# Altium project ESE516_Whiskeypedia_A5.PrjPcb (part 1 of 2)
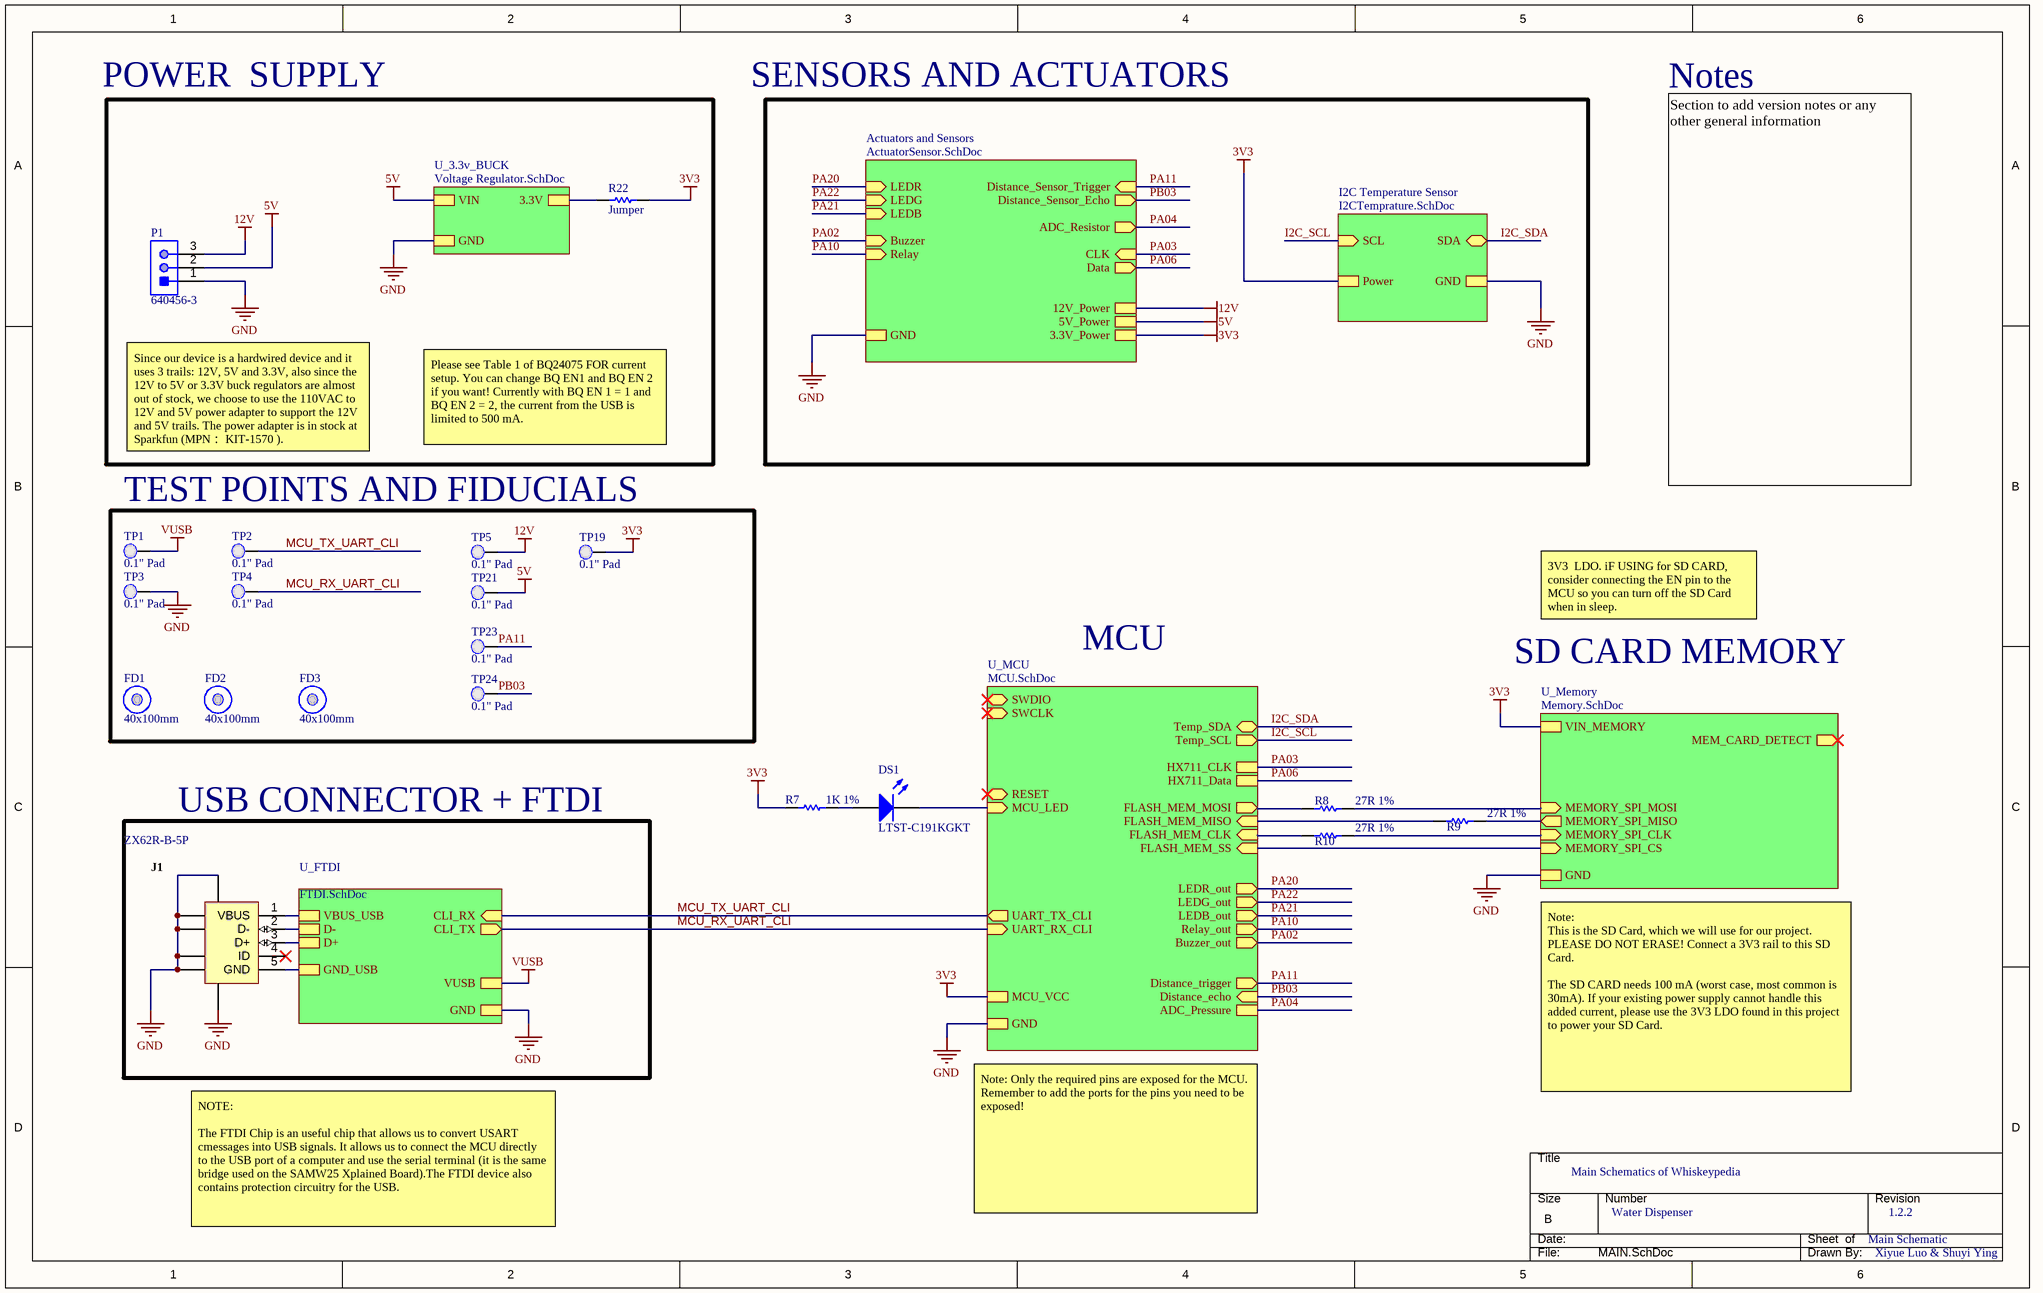
[diagram p0: MAIN.SchDoc]
7 sheets, 125 parts. Net scope: hierarchical (ports join the sheet entries above them; power ports are global).
Board file: ESE516_PCB.PcbDoc
Sheets:
  MAIN.SchDoc
    U_FTDI = FTDI.SchDoc
    U_MCU = MCU.SchDoc
    U_Memory = Memory.SchDoc
    U_3.3v_BUCK = Voltage Regulator.SchDoc
    Actuators and Sensors = ActuatorSensor.SchDoc
    I2C Temperature Sensor = I2CTemprature.SchDoc

## Sheet MAIN.SchDoc
size B

### Parts
DS1  LTST-C191KGKT  [LITE-ON-LTST-C191KRKT-2_V]
FD1  40x100mm  [Fiducial_FT]  (no BOM)
FD2  40x100mm  [Fiducial_FT]  (no BOM)
FD3  40x100mm  [Fiducial_FT]  (no BOM)
J1  ZX62R-B-5P  [HIRO-ZX62R-B-5P_V]
P1  640456-3  [TECO-640456-3]
R7  1K 1%  [RESC0603(1608)_N]
R8  27R 1%  [RESC1005X40X25NL10T10]
R9  27R 1%  [RESC1005X40X25NL10T10]
R10  27R 1%  [RESC1005X40X25NL10T10]
R22  Jumper  [RESC0805(2012)_N]
TP1  0.1" Pad  [PCBComponent]  (no BOM)
TP2  0.1" Pad  [PCBComponent]  (no BOM)
TP3  0.1" Pad  [PCBComponent]  (no BOM)
TP4  0.1" Pad  [PCBComponent]  (no BOM)
TP5  0.1" Pad  [PCBComponent]  (no BOM)
TP19  0.1" Pad  [PCBComponent]  (no BOM)
TP21  0.1" Pad  [PCBComponent]  (no BOM)
TP23  0.1" Pad  [PCBComponent]  (no BOM)
TP24  0.1" Pad  [PCBComponent]  (no BOM)

### Blocks framed on the sheet
TEST POINTS AND FIDUCIALS: FD1-FD3 TP1-TP5 TP19 TP21 TP23 TP24
USB CONNECTOR + FTDI: J1

### Sub-sheets
Actuators and Sensors = ActuatorSensor.SchDoc: LEDR (in), LEDG (in), LEDB (in), Buzzer (in), Relay (in), Distance_Sensor_Trigger (in), Distance_Sensor_Echo (out), GND, 5V_Power, 3.3V_Power, 12V_Power, ADC_Resistor (out), CLK (in), Data (out)
I2C Temperature Sensor = I2CTemprature.SchDoc: SCL (in), Power, SDA (bidir), GND
U_3.3v_BUCK = Voltage Regulator.SchDoc: VIN, 3.3V, GND
U_FTDI = FTDI.SchDoc: CLI_RX (in), CLI_TX (out), VUSB, GND, VBUS_USB, D-, D+, GND_USB
U_MCU = MCU.SchDoc: SWDIO (bidir), SWCLK (in), UART_TX_CLI (out), UART_RX_CLI (in), FLASH_MEM_SS (in), FLASH_MEM_CLK (in), FLASH_MEM_MISO (in), FLASH_MEM_MOSI (out), RESET (bidir), MCU_LED (in), MCU_VCC, GND, LEDR_out (out), LEDG_out (out), LEDB_out (out), Relay_out (out), Buzzer_out (out), Distance_trigger (out), Distance_echo (in), Temp_SDA (bidir), Temp_SCL (out), ADC_Pressure, HX711_CLK, HX711_Data
U_Memory = Memory.SchDoc: MEMORY_SPI_MOSI (in), MEMORY_SPI_MISO (out), MEMORY_SPI_CLK (in), MEMORY_SPI_CS (in), MEM_CARD_DETECT (out), VIN_MEMORY, GND

### Nets
3V3: R7.1 R22.1 R22.2 TP19.1(PAD) ; sheet U_MCU/MCU_VCC, sheet U_Memory/VIN_MEMORY, sheet U_3.3v_BUCK/3.3V, sheet Actuators and Sensors/3.3V_Power, sheet I2C Temperature Sensor/Power
5V: P1.2 TP21.1(PAD) ; sheet U_3.3v_BUCK/VIN, sheet Actuators and Sensors/5V_Power
12V: P1.3 TP5.1(PAD) ; sheet Actuators and Sensors/12V_Power
GND: J1.6(SHLD) J1.7(SHLD) J1.8(SHLD) J1.9(SHLD) J1.10(SHLD) J1.11(SHLD) P1.1 TP3.1(PAD) ; sheet U_FTDI/GND, sheet U_MCU/GND, sheet U_Memory/GND, sheet U_3.3v_BUCK/GND, sheet Actuators and Sensors/GND, sheet I2C Temperature Sensor/GND
VUSB: TP1.1(PAD) ; sheet U_FTDI/VUSB
FLASH_MEM_SPI_SS: sheet U_MCU/FLASH_MEM_SS, sheet U_Memory/MEMORY_SPI_CS
GND_USB: J1.5(GND) ; sheet U_FTDI/GND_USB
I2C_SCL: sheet U_MCU/Temp_SCL, sheet I2C Temperature Sensor/SCL
I2C_SDA: sheet U_MCU/Temp_SDA, sheet I2C Temperature Sensor/SDA
MCU_LED: DS1.2(K) ; sheet U_MCU/MCU_LED
MCU_RX_UART_CLI: TP4.1(PAD) ; sheet U_FTDI/CLI_TX, sheet U_MCU/UART_RX_CLI
MCU_TX_UART_CLI: TP2.1(PAD) ; sheet U_FTDI/CLI_RX, sheet U_MCU/UART_TX_CLI
MEM_SPI_CLK: R10.2 ; sheet U_Memory/MEMORY_SPI_CLK
MEM_SPI_MISO: R9.2 ; sheet U_Memory/MEMORY_SPI_MISO
MEM_SPI_MOSI: R8.2 ; sheet U_Memory/MEMORY_SPI_MOSI
PA02: sheet U_MCU/Buzzer_out, sheet Actuators and Sensors/Buzzer
PA03: sheet U_MCU/HX711_CLK, sheet Actuators and Sensors/CLK
PA04: sheet U_MCU/ADC_Pressure, sheet Actuators and Sensors/ADC_Resistor
PA06: sheet U_MCU/HX711_Data, sheet Actuators and Sensors/Data
PA10: sheet U_MCU/Relay_out, sheet Actuators and Sensors/Relay
PA11: TP23.1(PAD) ; sheet U_MCU/Distance_trigger, sheet Actuators and Sensors/Distance_Sensor_Trigger
PA20: sheet U_MCU/LEDR_out, sheet Actuators and Sensors/LEDR
PA21: sheet U_MCU/LEDB_out, sheet Actuators and Sensors/LEDB
PA22: sheet U_MCU/LEDG_out, sheet Actuators and Sensors/LEDG
PB03: TP24.1(PAD) ; sheet U_MCU/Distance_echo, sheet Actuators and Sensors/Distance_Sensor_Echo
SERCOM1_PAD2_SPI_MISO: R9.1 ; sheet U_MCU/FLASH_MEM_MISO
SERCOM1_PAD2_SPI_MOSI: R8.1 ; sheet U_MCU/FLASH_MEM_MOSI
SERCOM1_PAD3_SPI_SCK: R10.1 ; sheet U_MCU/FLASH_MEM_CLK
USB_DATA_N: J1.2(D-) ; sheet U_FTDI/D-
USB_DATA_P: J1.3(D+) ; sheet U_FTDI/D+
VBUS_USB: J1.1(VBUS) ; sheet U_FTDI/VBUS_USB
NetDS1_1: DS1.1(A) R7.2

Not connected (* = marked no-connect by the designer): J1 4(ID)*

### Notes on the sheet
- POWER  SUPPLY
- SENSORS AND ACTUATORS
- Notes
- Since our device is a hardwired device and it uses 3 trails: 12V, 5V and 3.3V, also since the 12V to 5V or 3.3V buck regulators are almost out of stock, we choose to use the 110VAC to 12V and 5V power adapter to support the 12V and 5V trails. The power adapter is in stock at Sparkfun (MPN： KIT-1570 ).
- Please see Table 1 of BQ24075 FOR current setup. You can change BQ EN1 and BQ EN 2 if you want! Currently with BQ EN 1 = 1 and BQ EN 2 = 2, the current from the USB is limited to 500 mA.
- Section to add version notes or any other general information
- 3V3  LDO. iF USING for SD CARD, consider connecting the EN pin to the MCU so you can turn off the SD Card when in sleep.
- MCU
- SD CARD MEMORY
- Note:
  This is the SD Card, which we will use for our project. PLEASE DO NOT ERASE! Connect a 3V3 rail to this SD Card.
  The SD CARD needs 100 mA (worst case, most common is 30mA). If your existing power supply cannot handle this added current, please use the 3V3 LDO found in this project to power your SD Card.
- Main Schematics of Whiskeypedia
- NOTE:
  The FTDI Chip is an useful chip that allows us to convert USART cmessages into USB signals. It allows us to connect the MCU directly to the USB port of a computer and use the serial terminal (it is the same bridge used on the SAMW25 Xplained Board).The FTDI device also contains protection circuitry for the USB.
- Note: Only the required pins are exposed for the MCU. Remember to add the ports for the pins you need to be exposed!
- Water Dispenser
- Main Schematic
- 1.2.2
- Xiyue Luo & Shuyi Ying

### Library data of the parts
DS1 = CMP-2000-05198-1: Chip LED, Green, 574 nm, 40 pF, -55 to 85 degC, 2-Pin SMD, RoHS, Tape and Reel; Manufacturer: Lite-On; Rad Hardened: No; Emitting Color: YellowGreen; Product Height (mm): 0.55mm; Forward Voltage: 2.4V; Number of Elements: 1; Dominant Wave Length: 571nm; DELETED: Compliant; Viewing Angle: 130deg; High Brightness: Yes; Peak Wavelength: 574nm; Type: Uni-Color; Forward Current: 30mA; Product Length (mm): 1.6mm; Luminous Intensity: 35mcd; Test Current (It): 20mA; Chip Material: AlGaInP; Product Depth (mm): 0.8mm; Shape Type: Rectangular; Reverse Voltage: 5V; Power Dissipation: 75W; Pin Count: 2; Lens Dimensions: 1.1X0.8X0.37mm; Packaging: TapeandReel; Main Category: ChipLED; Operating Temperature Classification: Industrial; Package Type: ChipLed; Mounting: SurfaceMount; Lum Intensity: 35mcd; Operating Temp Range: -55Cto85C; Datasheet Version: Jan-07; Datasheet URL: http://download.siliconexpert.com/pdfs/2007/08/26/semi_b/manual/lot/ds/ltst-c191kgkt.pdf; Manufacturer URL: http://www.us.liteon.com/
FD1-FD3 = CMP-00174-A.4: Fiducial 40x100mm
J1 = CMP-0031-00001-1: Connector; USBMicro-B,Reverse type, SMT; 5 Position; Right Angle; DatasheetVersion: 08/2010; Operating Temperature: -30 to 85 degC; Mounting Technology: Surface Mount; PartNumber: ZX62R-B-5P; PackageReference: ZX62R-B-5P; ComponentLink2URL: http://www.hirose.co.jp/cataloge_hp/e24200011.pdf; ComponentLink1URL: http://www.hirose.com/â€Ž; ComponentLink2Description: Datasheet; PackageDescription: 5-Pin USB Micro-B R/A Connector; ComponentLink1Description: Manufacturer URL
P1 = CMP-2000-05418-1: Male Header, Pitch 2.54 mm, 1 x 3 Position, Height 10.03 mm, Tail Length 3.56 mm, -55 to 105 degC; Manufacturer: TE Connectivity; Agency Approvals: CSA,UL; Angle: Straight; Number of Positions: 3; Standards: RoHSCompliant,ELVCompliant,UL94V-0; Current, Rating: 5 / A; Connector Type: MTA-100; Mount Angle: Vertical; Material, Housing: Polyester; Temperature, Operating: -55to+105 / degC; Voltage, Rating: 250 / V; Color, Housing: White; Contact Centerline Spacing: 0.100 / in.; Special Features: Pinstrip; Material, Contact: CopperAlloy; Contact Termination Area Plating: Tin; Primary Type: InterconnectSystem; Pin Spacing: 0.1 / "; Brand/Series: MTA-100Series; Mounting Hole Size: 0.04 / "; Manufacturer URL: http://www.te.com/; Datasheet URL: https://datasheet.ciiva.com/16456/eng-ds-82056-mta-0608-16456886.pdf; Flammability Rating: UL94V-0; Mounting Type: PCMount; Contact Mating Area Plating: Tin; Datasheet Version: Jun-08; Number of Rows: 1; Termination: Solder; Type: PCBPlug; Length, Pin: 0.14 / "; Color: White; Contact Plating: Tin; Contact Shape: Square; Number of Contacts: 3; Size, Post: 0.025 / in.; Length, Terminal Post: 0.14 / in.; Length, Overall: 0.3 / "
R7 = CMP-1012-00510-1: 1K 0.1W 1% 0603 (1608 Metric)  SMD; Case-Metric: 1608; Case-EIA: 0603; Value: 1000.00 Ohm; Technology: SMT; Tolerance: 1 %; Power: 0.1 W
R8-R10 = CMP-2002-06087-1: Manufacturer: Multicomp; Part Number: MC00625W0402127R
R22 = CMP-1013-00001-1: Jumper 0805 (2012 Metric); Case-EIA: 0805; Value: 0.00 Ohm; Tolerance: None; Case-Metric: 2012; Technology: SMT; Power: None
TP1-TP5 TP19 TP21 TP23 TP24 = 0.1" Pad-A.4

## Sheet FTDI.SchDoc
size A
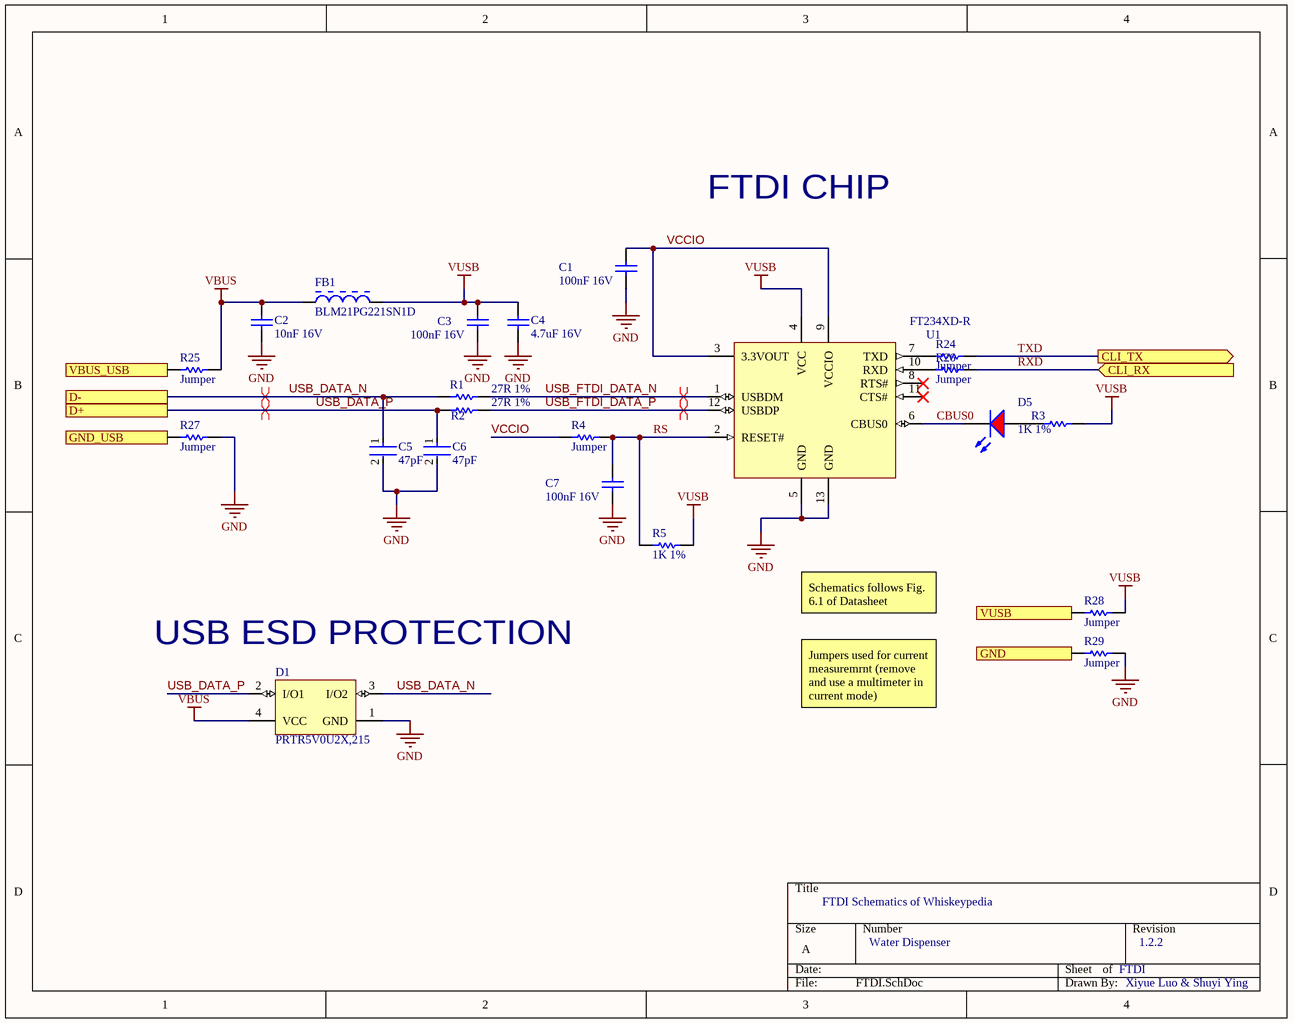
[diagram p1: FTDI.SchDoc]

### Parts
C1  100nF 16V  [CAPC0603(1608)100_N]
C2  10nF 16V  [CAPC0603(1608)100_N]
C3  100nF 16V  [CAPC0603(1608)100_N]
C4  4.7uF 16V  [CAPC0805(2012)145_N]
C5  47pF  [FP-C0603C-CF-MFG]
C6  47pF  [FP-C0603C-CF-MFG]
C7  100nF 16V  [CAPC0603(1608)100_N]
D1  PRTR5V0U2X,215  [NXP-SOT143B-4_V]
D5  LTST-C170CKT  [LTST-C170CKT_V]  (value not drawn)
FB1  BLM21PG221SN1D  [MURA-BLM21-B20-CHIP-2_V2]
R1  27R 1%  [RESC1005X40X25NL10T10]
R2  27R 1%  [RESC1005X40X25NL10T10]
R3  1K 1%  [RESC0603(1608)_N]
R4  Jumper  [RESC0805(2012)_N]
R5  1K 1%  [RESC0603(1608)_N]
R24  Jumper  [RESC0805(2012)_N]
R25  Jumper  [RESC0805(2012)_N]
R26  Jumper  [RESC0805(2012)_N]
R27  Jumper  [RESC0805(2012)_N]
R28  Jumper  [RESC0805(2012)_N]
R29  Jumper  [RESC0805(2012)_N]
U1  FT234XD-R  [DFN-12_V]

### Ports
CLI_RX (in), CLI_TX (out), D+, D-, GND, GND_USB, VBUS_USB, VUSB

### Nets
GND: C1.1 C2.1 C3.1 C4.1 C5.2 C6.2 C7.1 D1.1(GND) R27.2 R29.1 R29.2 U1.5(GND) U1.13(GND) ; port GND
VBUS: C2.2 D1.4(VCC) FB1.1 R25.2
VUSB: C3.2 C4.2 FB1.2 R3.2 R5.1 R28.1 R28.2 U1.4(VCC) ; port VUSB
CBUS0: D5.2(K) U1.6(CBUS0)
GND_USB: R27.1 ; port GND_USB
RS: C7.2 R4.2 R5.2 U1.2(RESET#)
RXD: R26.2 ; port CLI_RX  [project net MCU_TX_UART_CLI]
TXD: R24.2 ; port CLI_TX  [project net MCU_RX_UART_CLI]
USB_DATA_N: C5.1 D1.3(I/O2) R1.1 ; port D-
USB_DATA_P: C6.1 D1.2(I/O1) R2.1 ; port D+
USB_FTDI_DATA_N: R1.2 U1.1(USBDM)
USB_FTDI_DATA_P: R2.2 U1.12(USBDP)
VBUS_USB: R25.1 ; port VBUS_USB
VCCIO: C1.2 R4.1 U1.3(3.3VOUT) U1.9(VCCIO)
NetD5_1: D5.1(A) R3.1
NetR24_1: R24.1 U1.7(TXD)
NetR26_1: R26.1 U1.10(RXD)

Not connected (* = marked no-connect by the designer): U1 8(RTS#)* 11(CTS#)*

### Layout directives
differential pair: USB_DATA_N, USB_DATA_P, USB_FTDI_DATA_N, USB_FTDI_DATA_P

### Notes on the sheet
- FTDI CHIP
- Schematics follows Fig. 6.1 of Datasheet
- (near D1) USB ESD PROTECTION
- Jumpers used for current measuremrnt (remove and use a multimeter in current mode)
- FTDI Schematics of Whiskeypedia
- Water Dispenser
- FTDI
- 1.2.2
- Xiyue Luo & Shuyi Ying

### Library data of the parts
C1 C3 C7 = CMP-1035-02584-1: CAP 100nF 16V ±10% 0603 (1608 Metric) Thickness 1mm SMD; Tolerance: Â±10%; Case-EIA: 0603; Case-Metric: 1608; Technology: SMT; Max Thickness: 1 mm; Value: 100nF; Rated Voltage: 16 V
C2 = CMP-1035-02311-1: CAP 10nF 16V ±10% 0603 (1608 Metric) Thickness 1mm SMD; Case-EIA: 0603; Case-Metric: 1608; Tolerance: Â±10%; Rated Voltage: 16 V; Value: 10nF; Max Thickness: 1 mm; Technology: SMT
C4 = CMP-1036-04893-1: CAP 4.7uF 16V -20% to +80% 0805 (2012 Metric) Thickness 1.45mm SMD; Case-Metric: 2012; Case-EIA: 0805; Max Thickness: 1.45 mm; Value: 4.7uF; Rated Voltage: 16 V; Tolerance: -20% to +80%; Technology: SMT
C5 C6 = CMP-03020-020014-1: CAP CER 47PF 16V NP0 0603; Manufacturer Part Number: C0603C470J4GAC7867; Manufacturer: KEMET; Material: Ceramic; Temperature Characteristic: C0G; Temperature Coefficient: 30ppm/°C; Automotive Grade: Grade 1; Tolerance: 0.05; Category: Cap; Package: C0603C-CF; Temperature Range Low: -55°C; Octopart: https://octopart.com/c0603c470j4gac7867-kemet-2107619; Height: 0.87mm; Value: 47 pF; Device Class L2: Capacitors; RoHS: TRUE; ComponentLink2URL: https://api.kemet.com/component-edge/download/datasheet/C0603C100J5GACAUTO.pdf; Voltage Rating: 16 V; Capacitance: 47 pF; Automotive: Yes; Device Class L1: Passive Components; Digikey Description: CAP CER 47PF 16V NP0 0603; ComponentLink2Description: Datasheet; Temperature Range High: +125°C; Device Class L3: Ceramic Capacitors; Lead Free: Yes; Temperature: -55°C to +125°C
D1 = CMP-2000-05285-1: Ultra Low Capacitance Double Rail-to-Rail ESD Protection Diode, 5.5 V, 1 pF, -40 to 85 degC, 4-Pin SOT143B, RoHS, Tape and Reel; Manufacturer: NXP Semiconductors; Capacitance Value: 16pF; Number of Elements: 1; Rad Hardened: No; Reverse Breakdown Voltage: 6V; Working Voltage (Max): 5.5V; Polarity: Uni-Directional; Configuration: Quad; Leakage Current: 0.1uA; Product Height (mm): 1mm; Suppressor Type: DiodeArrays; Product Length (mm): 3mm; Product Depth (mm): 1.4mm; ESD Protection Voltage: 8KV@ContactDisc; Package Type: SOT; Mounting: SurfaceMount; Packaging: TapeandReel; Datasheet Version: Rev. 02, 01/2008; Reverse Stand-off Voltage: 5.5V; Manufacturer URL: http://www.nxp.com/; Operating Temp Range: -40Cto85C; Operating Temperature Classification: Industrial; Working Voltage: 5.5V; Operating Temperature Min Deg. C: -40C; Datasheet URL: https://datasheet.ciiva.com/4479/prtr5v0u2x-102853-4479461.pdf; Leakage Current (Max): 0.1uA; Direction Type: Uni-Directional; Pin Count: 3+Tab; Operating Temperature Max Deg. C: 85C; Mounting Style: SurfaceMount; Package / Case: SOT
D5 = CMP-1674-00001-5: LED Uni-Color Red, 100 mW, 200 mA, -55 to 85 degC, 2-Pin SMD, RoHS, Tape and Reel; Manufacturer: Lite-On; PackageReference: C170CKT; ComponentLink1Description: Manufacturer URL; ComponentLink1URL: http://www.us.liteon.com/; Package Quantity: 3000; Packaging: Tape and Reel; Pins: 2; ComponentLink2URL: http://media.digikey.com/pdf/Data%20Sheets/Lite-On%20PDFs/LTST-C170CKT.pdf; Max Operating Temperature: 85 degC; Min Operating Temperature: -55 degC; Mounting Technology: Surface Mount; Mount: Surface Mount; Length: 2 mm; ComponentLink2Description: Datasheet; DatasheetVersion: 03/2003; Height: 1.1 mm; PackageDescription: 2-Pin Surface Mount Device, Body 2 x 1.25 mm; RoHSCompliant: true; Colour: Red
FB1 = CMP-0686-00610-2: Chip Ferrite Bead for Power Lines, 220 Ohm, 2000 mA, -55 to 125 degC, 2 x 1.25 x 1.05 mm SMD, Tape and Reel; Manufacturer: Murata; DC Resistance: 0.045 Ohm Max.; Impedance (at 100 MHz): 220 Ohm +/- 25%; Rated Current: 2000 mA; PartNumber: BLM21PG221SN1D; Mounting Technology: Surface Mount; DatasheetVersion: 08/2013; ComponentLink3URL: http://www.murata.com/products/catalog/pdf/c31e.pdf; ComponentLink1URL: http://www.murata.com/; ComponentLink1Description: Manufacturer URL; ComponentLink2URL: http://www.murata.com/products/catalog/pdf/c31e.pdf; PackageDescription: 2-Pin Chip, Body 2 x 1.25 mm; ComponentLink3Description: Package Specification; Operating Temperature Range: -55 to 125 degC; Packing: Tape and Reel; ComponentLink2Description: Datasheet; PackageReference: BLM21_H1050-2
R1 R2 = CMP-2002-06087-1: as R8 on sheet MAIN
R3 R5 = CMP-1012-00510-1: as R7 on sheet MAIN; Technology: SMT; Tolerance: 1 %; Power: 0.1 W
R4 R24-R29 = CMP-1013-00001-1: as R22 on sheet MAIN; Technology: SMT; Power: None
U1 = CMP-0248-00027-1: FT234XD USB to BASIC UART IC, -40 to +85 degC, 12-Pin DFN, Pb-Free, Tape and Reel; Manufacturer: FTDI; PackageReference: DFN-12; PackageVersion: Feb-13; DatasheetVersion: ver 1.1, Feb-2013; ComponentLink1URL: http://www.ftdichip.com/; PartNumber: FT234XD-R; ComponentLink2URL: http://www.ftdichip.com/Support/Documents/DataSheets/ICs/DS_FT234XD.pdf; ComponentLink1Description: Manufacturer URL; PackageDescription: 12-Pin Dual Flat No-Lead, 3 x 3 mm Body, 0.45 mm Pitch, Exposed Pad; ComponentLink2Description: Datasheet

## Sheet MCU.SchDoc
size B
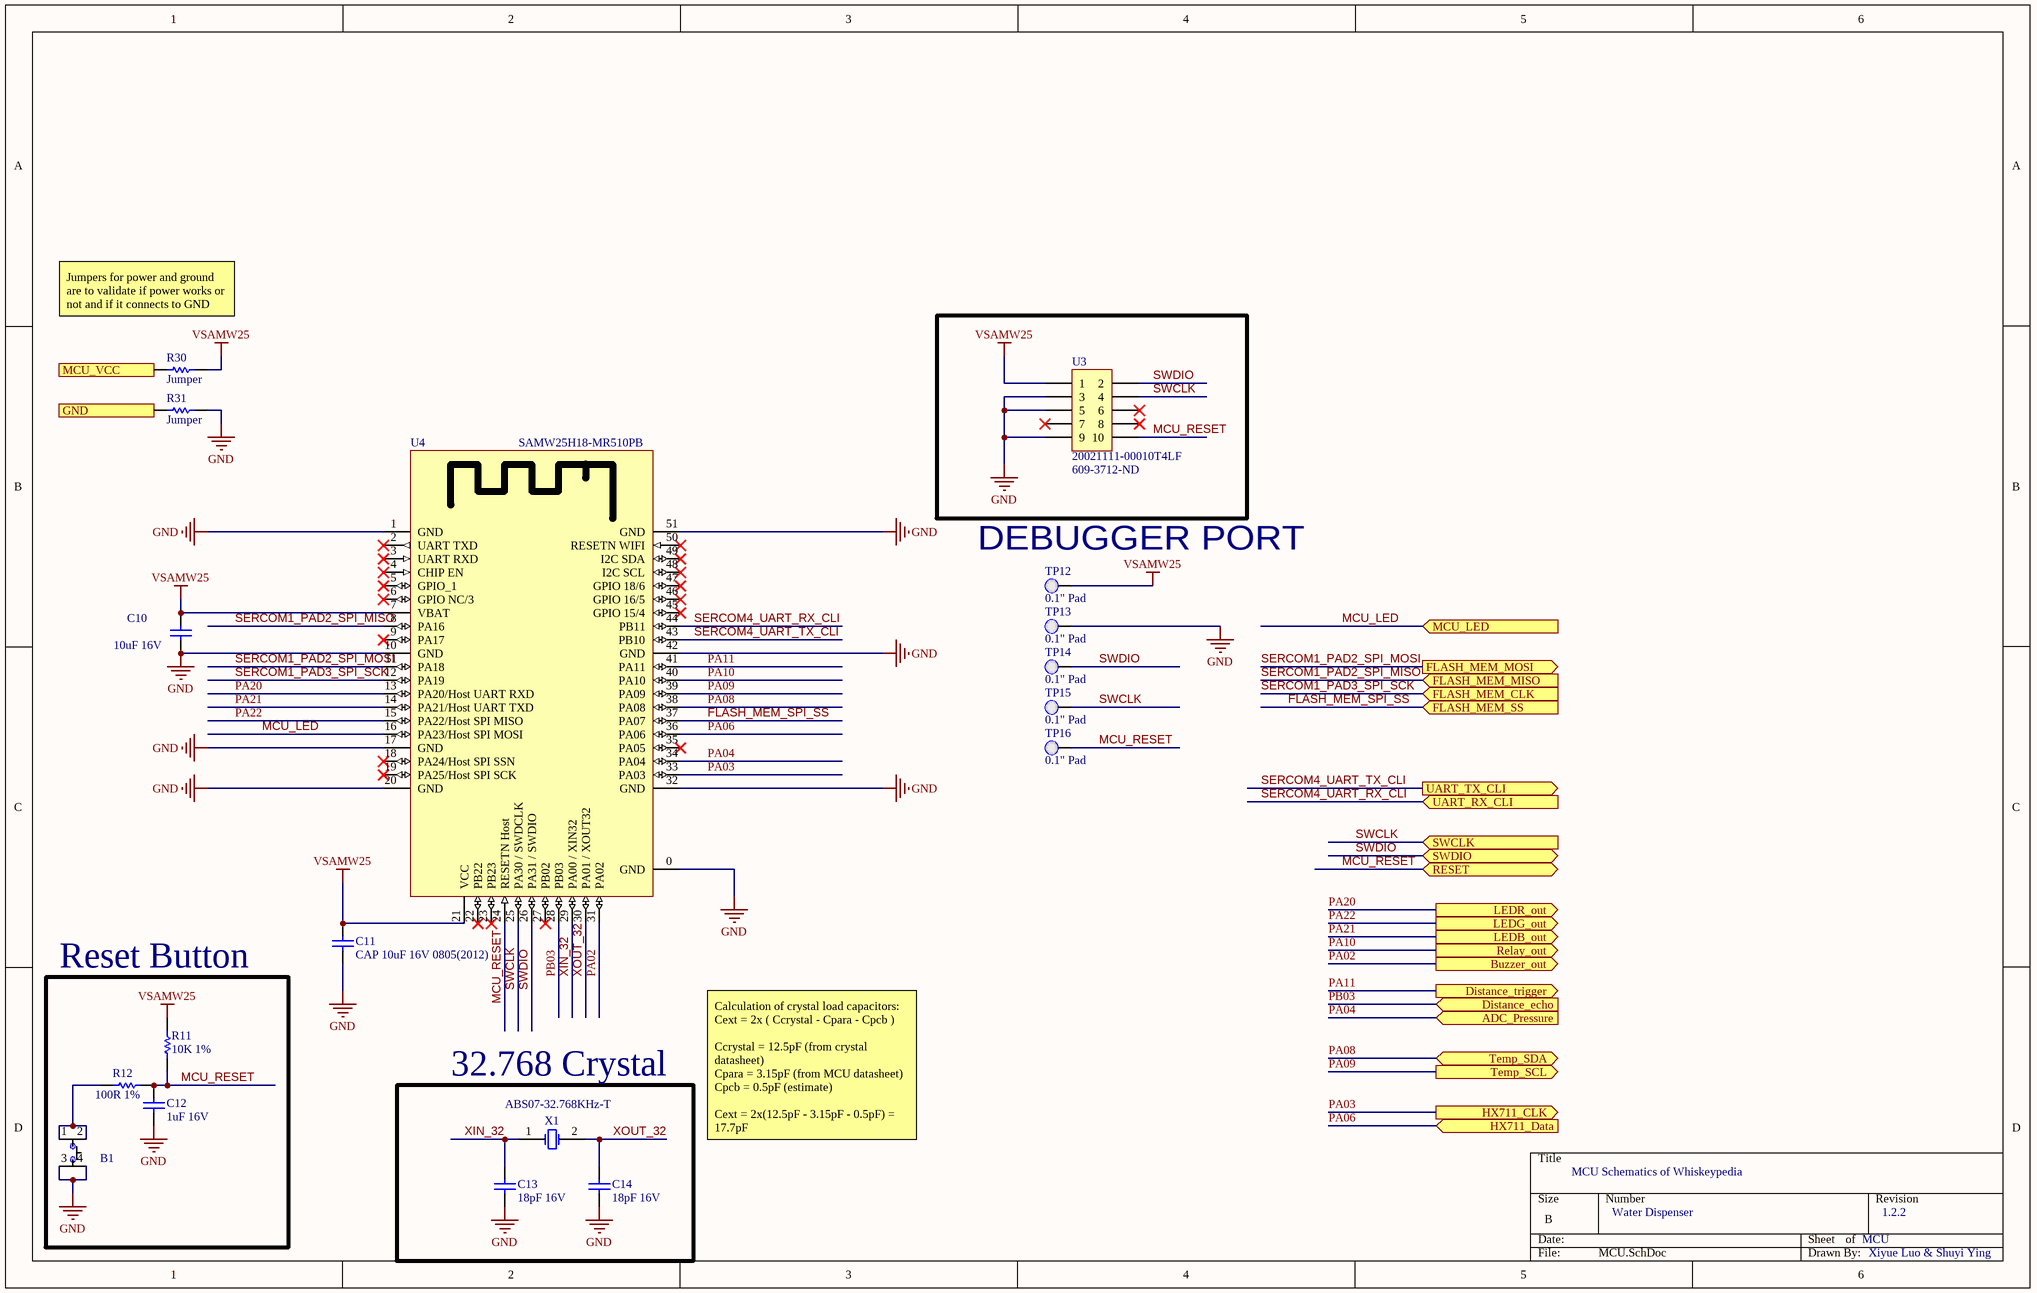
[diagram p2: MCU.SchDoc]

### Parts
B1  PTS810 SJK 250 SMTR LFS  [PTS810 SJK 250 SMTR LFS]  (value not drawn)
C10  10uF 16V  [CAPC0805(2012)145_N]
C11  CAP 10uF 16V 0805(2012)  [CAPC0805(2012)145_N]
C12  1uF 16V  [CAPC0603(1608)100_N]
C13  18pF 16V  [CAPC0603(1608)100_N]
C14  18pF 16V  [CAPC0603(1608)100_N]
R11  10K 1%  [RESC0603(1608)_N]
R12  100R 1%  [RESC0603(1608)_N]
R30  Jumper  [RESC0805(2012)_N]
R31  Jumper  [RESC0805(2012)_N]
TP12  0.1" Pad  [PCBComponent]  (no BOM)
TP13  0.1" Pad  [PCBComponent]  (no BOM)
TP14  0.1" Pad  [PCBComponent]  (no BOM)
TP15  0.1" Pad  [PCBComponent]  (no BOM)
TP16  0.1" Pad  [PCBComponent]  (no BOM)
U3  20021111-00010T4LF  Supplier Part Number 1: 609-3712-ND  [20021111-00010T4LF]
U4  SAMW25H18-MR510PB  [SAMW25H18-MR510PB]
X1  ABS07-32.768KHz-T  [ABRA-ABS07-2_V]

### Blocks framed on the sheet
Reset Button: B1 C12 R11 R12
32.768 Crystal: C13 C14 X1

### Ports
ADC_Pressure (in), Buzzer_out (out), Distance_echo (in), Distance_trigger (out), FLASH_MEM_CLK (in), FLASH_MEM_MISO (in), FLASH_MEM_MOSI (out), FLASH_MEM_SS (in), GND, HX711_CLK (out), HX711_Data (in), LEDB_out (out), LEDG_out (out), LEDR_out (out), MCU_LED (in), MCU_VCC, Relay_out (out), RESET (bidir), SWCLK (in), SWDIO (bidir), Temp_SCL (out), Temp_SDA (bidir), UART_RX_CLI (in), UART_TX_CLI (out)

### Nets
3V3: R30.1 ; port MCU_VCC
GND: B1.3 B1.4 C10.1 C11.1 C12.1 C13.1 C14.1 R31.1 R31.2 TP13.1(PAD) U3.3 U3.5 U3.9 U4.0(GND) U4.1(GND) U4.10(GND) U4.17(GND) U4.20(GND) U4.32(GND) U4.42(GND) U4.51(GND) ; port GND
VSAMW25: C10.2 C11.2 R11.2 R30.2 TP12.1(PAD) U3.1 U4.7(VBAT) U4.21(VCC)
FLASH_MEM_SPI_SS: U4.37(PA07) ; port FLASH_MEM_SS
MCU_LED: U4.16(PA23/Host_SPI_MOSI) ; port MCU_LED
MCU_RESET: C12.2 R11.1 R12.2 TP16.1(PAD) U3.10 U4.24(RESETN_Host) ; port RESET
PA02: U4.31(PA02) ; port Buzzer_out
PA03: U4.33(PA03) ; port HX711_CLK
PA04: U4.34(PA04) ; port ADC_Pressure
PA06: U4.36(PA06) ; port HX711_Data
PA08: U4.38(PA08) ; port Temp_SDA  [project net I2C_SDA]
PA09: U4.39(PA09) ; port Temp_SCL  [project net I2C_SCL]
PA10: U4.40(PA10) ; port Relay_out
PA11: U4.41(PA11) ; port Distance_trigger
PA20: U4.13(PA20/Host_UART_RXD) ; port LEDR_out
PA21: U4.14(PA21/Host_UART_TXD) ; port LEDB_out
PA22: U4.15(PA22/Host_SPI_MISO) ; port LEDG_out
PB03: U4.28(PB03) ; port Distance_echo
SERCOM1_PAD2_SPI_MISO: U4.8(PA16) ; port FLASH_MEM_MISO
SERCOM1_PAD2_SPI_MOSI: U4.11(PA18) ; port FLASH_MEM_MOSI
SERCOM1_PAD3_SPI_SCK: U4.12(PA19) ; port FLASH_MEM_CLK
SERCOM4_UART_RX_CLI: U4.44(PB11) ; port UART_RX_CLI  [project net MCU_RX_UART_CLI]
SERCOM4_UART_TX_CLI: U4.43(PB10) ; port UART_TX_CLI  [project net MCU_TX_UART_CLI]
SWCLK: TP15.1(PAD) U3.4 U4.25(PA30_/_SWDCLK) ; port SWCLK
SWDIO: TP14.1(PAD) U3.2 U4.26(PA31_/_SWDIO) ; port SWDIO
XIN_32: C13.2 U4.29(PA00_/_XIN32) X1.1(X1)
XOUT_32: C14.2 U4.30(PA01_/_XOUT32) X1.2(X2)
NetB1_1: B1.1 B1.2 R12.1

Not connected (* = marked no-connect by the designer): U3 6* 7* 8*; U4 2(UART_TXD)* 3(UART_RXD)* 4(CHIP_EN)* 5(GPIO_1)* 6(GPIO_NC/3)* 9(PA17)* 18(PA24/Host_SPI_SSN)* 19(PA25/Host_SPI_SCK)* 22(PB22)* 23(PB23)* 27(PB02)* 35(PA05)* 45(GPIO_15/4)* 46(GPIO_16/5)* 47(GPIO_18/6)* 48(I2C_SCL)* 49(I2C_SDA)* 50(RESETN_WIFI)*

### Notes on the sheet
- Jumpers for power and ground are to validate if power works or not and if it connects to GND
- (near TP12) DEBUGGER PORT
- Calculation of crystal load capacitors:
  Cext = 2x ( Ccrystal - Cpara - Cpcb )
  Ccrystal = 12.5pF (from crystal datasheet)
  Cpara = 3.15pF (from MCU datasheet)
  Cpcb = 0.5pF (estimate)
  Cext = 2x(12.5pF - 3.15pF - 0.5pF) = 17.7pF
- MCU Schematics of Whiskeypedia
- Water Dispenser
- MCU
- 1.2.2
- Xiyue Luo & Shuyi Ying

### Library data of the parts
B1 = PTS810 SJK 250 SMTR LFS: SWITCH TACTILE SPST-NO 0.05A 16V Tactile Switch SPST-NO Top Actuated Surface Mount; Manufacturer: ITT /  C&K Components; Part # Aliases: Y97LT25B5DBFP; Operating Force: 2.6 N; Actuator: Oval; Current Rating: 50 mA; Voltage Rating DC: 16 VDC; Contact Form: SPST; Switch Function: OFF - (ON); Mounting Direction: Straight; Stem Height: 2.5 mm; Brand: C&K Components; Travel: 0.15 mm; Manufacturer Part Number: PTS810SJK250SMTRLFS; Product Category: Tactile Switches; RoHS: Details; Termination Style: J Form Lead; Mounting Style: SMD/SMT; Color: White; Packaging: Reel; Contact Plating: Silver; Operating Temperature Range: - 40 C to + 85 C; Series: PTS810; Factory Pack Quantity: 2900; ComponentLink1URL: https://datasheet.ciiva.com/18514/pts810-4mar13-18514061.pdf; ComponentLink1Description: https://datasheet.ciiva.com/18514/pts810-4mar13-18514061.pdf; ComponentLink2URL: https://datasheet.ciiva.com/18514/pts810-4mar13-18514062.pdf; ComponentLink2Description: https://datasheet.ciiva.com/18514/pts810-4mar13-18514062.pdf; ComponentLink3URL: https://datasheet.ciiva.com/18514/pts810-4mar13-18514063.pdf; ComponentLink3Description: https://datasheet.ciiva.com/18514/pts810-4mar13-18514063.pdf; Supplier 1: Digi-Key; Supplier Part Number 1: CKN10503CT-ND
C10 C11 = CMP-1036-04927-1: CAP 10uF 16V ±10% 0805 (2012 Metric) Thickness 1.45mm SMD; Case-EIA: 0805; Tolerance: Â±10%; Case-Metric: 2012; Rated Voltage: 16 V; Technology: SMT; Value: 10uF; Max Thickness: 1.45 mm
C12 = CMP-1035-02736-1: CAP 1uF 16V ±5% 0603 (1608 Metric) Thickness 1mm SMD; Case-Metric: 1608; Case-EIA: 0603; Tolerance: Â±5%; Technology: SMT; Max Thickness: 1 mm; Rated Voltage: 16 V; Value: 1uF
C13 C14 = CMP-1035-00738-1: CAP 18pF 16V ±5% 0603 (1608 Metric) Thickness 1mm SMD; Tolerance: Â±5%; Case-EIA: 0603; Case-Metric: 1608; Max Thickness: 1 mm; Rated Voltage: 16 V; Value: 18pF; Technology: SMT
R11 = CMP-1012-00623-1: 10K 0.1W 1% 0603 (1608 Metric)  SMD; Value: 10000.00 Ohm; Case-EIA: 0603; Case-Metric: 1608; Power: 0.1 W; Tolerance: 1 %; Technology: SMT
R12 = CMP-1012-00397-1: 100R 0.1W 1% 0603 (1608 Metric)  SMD; Value: 100.00 Ohm; Case-EIA: 0603; Case-Metric: 1608; Technology: SMT; Tolerance: 1 %; Power: 0.1 W
R30 R31 = CMP-1013-00001-1: as R22 on sheet MAIN; Technology: SMT; Power: None
TP12-TP16 = 0.1" Pad-A.4
U3 = 20021111-00010T4LF: CONN HEADER 10POS UNSHD VERT T/H; Manufacturer: Amphenol / FCI; Stack Height: 2.5 mm; Number of Positions / Contacts: 10; Brand: FCI; Pitch: 1.27 mm; Mounting Angle: Vertical; Current Rating: 10 A; Mating Post Length: 3.05 mm; Voltage Rating: 125 V; Manufacturer Part Number: 20021111-00010T4LF; Mounting Style: Through Hole; Product Category: Headers & Wire Housings; RoHS: Details; Series: Minitek; Product Type: Headers; Type: Unshrouded; Number of Positions: 10; Number of Rows: 2; Contact Plating: Gold; Housing Material: Plastic; Termination Style: Through Hole; Contact Material: Nickel; Packaging: Tube; Factory Pack Quantity: 93; Termination Post Length: 2.3 mm; ComponentLink1URL: https://datasheet.ciiva.com/1433/1079612-1433267.pdf; ComponentLink1Description: https://datasheet.ciiva.com/1433/1079612-1433267.pdf; ComponentLink2URL: https://datasheet.ciiva.com/409/20021111-409158.pdf; ComponentLink2Description: https://datasheet.ciiva.com/409/20021111-409158.pdf; ComponentLink3URL: https://datasheet.ciiva.com/5131/20021111-5131386.pdf; ComponentLink3Description: https://datasheet.ciiva.com/5131/20021111-5131386.pdf; ComponentLink4URL: https://datasheet.ciiva.com/9465/20021111-9465402.pdf; ComponentLink4Description: https://datasheet.ciiva.com/9465/20021111-9465402.pdf; Supplier 1: Digi-Key
U4 = SAMW25H18-MR510PB: RF TXRX MODULE WIFI TRACE ANT; Manufacturer: Atmel; Manufacturer Part Number: ATSAMW25H18-MR510PB; Protocol: 802.11b/g/n; Frequency: 2.4GHz; Data Rate: 65Mbps; Power - Output: 17dBm; Sensitivity: -95.5dBm; Serial Interfaces: SPI, UART; Antenna Type: Integrated, Trace; Memory Size: 256kB Flash, 32kB SRAM; Voltage - Supply: 2.7 V ~ 4.2 V; Category: RF/IF and RFID; Family: RF Transceiver Modules; Series: Xplained Pro; Packaging: Tray; RF Family/Standard: WiFi; Modulation: -; Current - Receiving: -; Current - Transmitting: -; Mounting Type: Surface Mount; Operating Temperature: -40°C ~ 85°C; Package / Case: Module; ComponentLink1URL: http://www.atmel.com/devices/ATSAMW25.aspx; ComponentLink1Description: http://www.atmel.com/devices/ATSAMW25.aspx; ComponentLink2URL: http://www.farnell.com/datasheets/1965115.pdf; ComponentLink2Description: http://www.farnell.com/datasheets/1965115.pdf; Supplier 1: Digikey; Stock 1: 120; Pricing 1: 1=19.14 (USD); Supplier Part Number 1: ATSAMW25H18-MR510PB-ND
X1 = CMP-0447-00001-2: Crystal, 32.768 kHz, 12.5 pF, -40 to 85 degC, SMD Low Profile 3.2 x 1.5 x 0.9 mm, Tape and Reel; Manufacturer: Abracon; Q Value (Type): 30000; Operation Mode: Flexural Mode (Tuning Fork); Shunt Capacitance (C0): 0.9 to 1.2 pF; Load Capacitance (CL): 12.5 pF; Frequency Tolerance @+25degC: +/- 20 ppm; Drive Level (Type): 0.1 uW; Equivalent Series Resistance (R1): 70 Kohm; Insulation Resistance (Min): 500 Mohm; ComponentLink3URL: http://www.abracon.com/Resonators/ABS07.pdf; PackageDescription: 2-Pin Hand Drawn, Body 3.2x1.5mm, Pitch 2.5mm; Operating Temperature: -40 to 85 degC; ComponentLink2URL: http://www.abracon.com/Resonators/ABS07.pdf; PackageReference: ABS07-2; ComponentLink3Description: Package Specification; ComponentLink1Description: Manufacturer URL; DatasheetVersion: 04.03.13; Mounting Technology: Surface Mount; ComponentLink2Description: Datasheet; ComponentLink1URL: http://www.abracon.com/; PartNumber: ABS07-32.768KHz-T; Packing: Tape and Reel; Frequency: 32.768 kHz

## Sheet Memory.SchDoc
size A
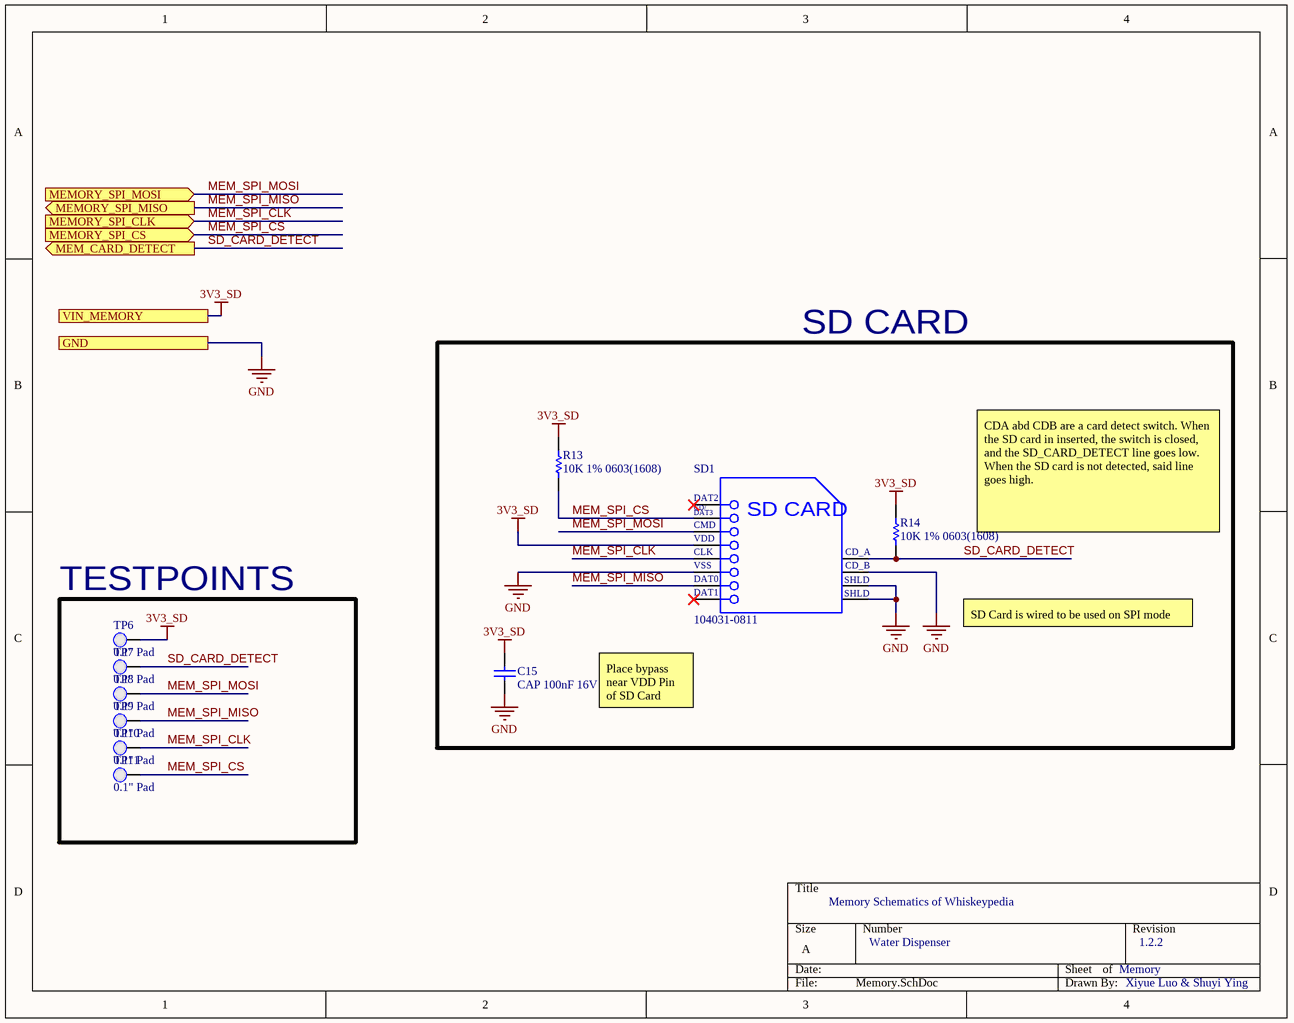
[diagram p3: Memory.SchDoc]

### Parts
C15  CAP 100nF 16V 0603(1608)  [CAPC0603(1608)100_N]
R13  10K 1% 0603(1608)  [RESC0603(1608)_N]
R14  10K 1% 0603(1608)  [RESC0603(1608)_N]
SD1  104031-0811  [MOLX-104031-0811_V]
TP6  0.1" Pad  [PCBComponent]  (no BOM)
TP7  0.1" Pad  [PCBComponent]  (no BOM)
TP8  0.1" Pad  [PCBComponent]  (no BOM)
TP9  0.1" Pad  [PCBComponent]  (no BOM)
TP10  0.1" Pad  [PCBComponent]  (no BOM)
TP11  0.1" Pad  [PCBComponent]  (no BOM)

### Blocks framed on the sheet
SD CARD: C15 R13 R14 SD1
TESTPOINTS: TP6-TP11

### Ports
GND, MEM_CARD_DETECT (out), MEMORY_SPI_CLK (in), MEMORY_SPI_CS (in), MEMORY_SPI_MISO (out), MEMORY_SPI_MOSI (in), VIN_MEMORY

### Nets
3V3_SD: C15.2 R13.2 R14.2 SD1.4(VDD) TP6.1(PAD) ; port VIN_MEMORY  [project net 3V3]
GND: C15.1 SD1.6(VSS2) SD1.10(CD_B) SD1.11(SHLD1) SD1.12(SHLD2) ; port GND
MEM_SPI_CLK: SD1.5(CLK) TP10.1(PAD) ; port MEMORY_SPI_CLK
MEM_SPI_CS: R13.1 SD1.2(CMD) TP11.1(PAD) ; port MEMORY_SPI_CS  [project net FLASH_MEM_SPI_SS]
MEM_SPI_MISO: SD1.7(DAT0) TP9.1(PAD) ; port MEMORY_SPI_MISO
MEM_SPI_MOSI: SD1.3(VSS1) TP8.1(PAD) ; port MEMORY_SPI_MOSI
SD_CARD_DETECT: R14.1 SD1.9(CD_A) TP7.1(PAD) ; port MEM_CARD_DETECT

Not connected (* = marked no-connect by the designer): SD1 1(CD/DAT3)* 8(DAT1)*

### Notes on the sheet
- CDA abd CDB are a card detect switch. When the SD card in inserted, the switch is closed, and the SD_CARD_DETECT line goes low. When the SD card is not detected, said line goes high.
- SD Card is wired to be used on SPI mode
- Place bypass near VDD Pin of SD Card
- Memory Schematics of Whiskeypedia
- Water Dispenser
- Memory
- 1.2.2
- Xiyue Luo & Shuyi Ying
- (in symbol CMP-2000-05825-1) DAT2; CD/; DAT3; SD CARD; VSS; SHLD

### Library data of the parts
C15 = CMP-1035-02584-1: as C1 on sheet FTDI; Technology: SMT; Max Thickness: 1 mm; Value: 100nF; Rated Voltage: 16 V
R13 R14 = CMP-1012-00623-1: as R11 on sheet MCU; Power: 0.1 W; Tolerance: 1 %; Technology: SMT
SD1 = CMP-2000-05825-1: Micro SD Card, RA, -25 to 85 degC, 8-Pin SMD, RoHS, Tape and Reel; Voltage Rating: 10VAC/DC; Number of Contacts: 8; Insertion - Extraction Style: Push-Pull; Pitch: 1.1mm; Mating Cycles: 10000; Brand: Molex; Current Rating: 500mA; Manufacturer URL: http://www.molex.com/; Card Type: microSD; Mounting Type: Standard; Height: 1.42mm; Mounting Technology: SurfaceMount; Contact Plating: Gold; Product Category: MemoryCardConnectors; Package Description: 8-Pin Surface Mount Device, Body 11.95 x 11.4 mm, Pitch 1.1 mm; Datasheet URL: http://www.molex.com/pdm_docs/sd/1040310811_sd.pdf; Termination Style: SMD; Length: 11.4mm; Housing Material: LiquidCrystalPolymer(LCP); Orientation: RightAngle; RoHS: True; Contact Material: PhosphorBronze; Datasheet Version: Rev. E, 04/2006; Packaging: Reel; Manufacturer: Molex; Series: 104031; Product: CardConnectors; Number of Rows: 1Row; Package Reference: 104031-0811
TP6-TP11 = 0.1" Pad-A.4

## Sheet Voltage Regulator.SchDoc
size A
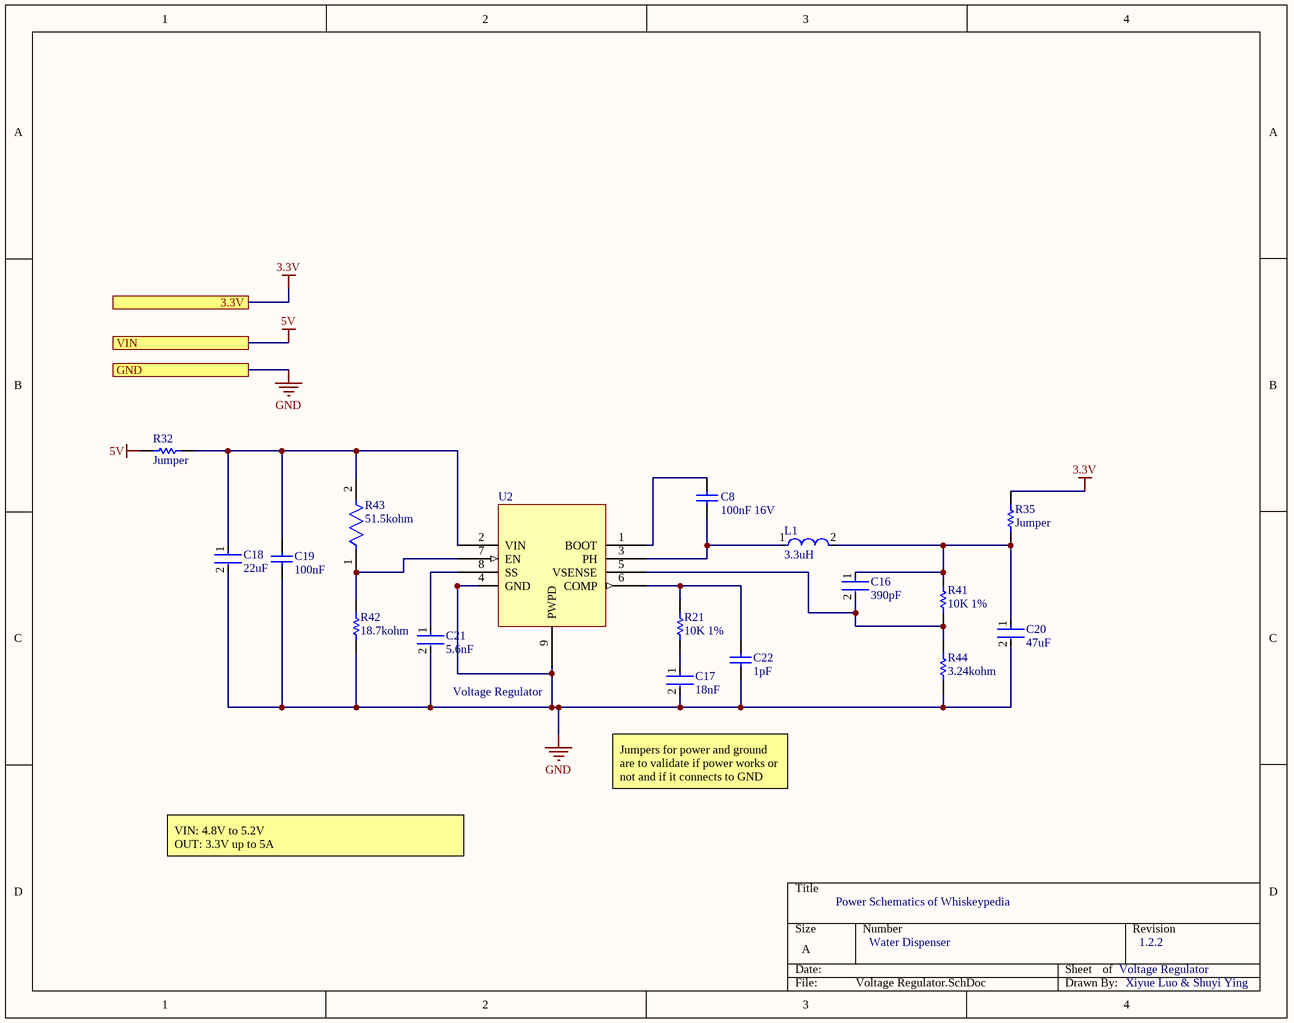
[diagram p4: Voltage Regulator.SchDoc]

### Parts
C8  100nF 16V  [CAPC0603(1608)100_N]
C16  390pF  [FP-CC0603-DA-MFG]
C17  18nF  [FP-GRM21B-0_1-IPC_A]
C18  22uF  [FP-GRM21B-0_2-e0_2_0_7-IPC_C]
C19  100nF  [CAPC1005X55X25NL05T10]
C20  47uF  [FP-GRM31C-0_2-e0_3_0_8-IPC_C]
C21  5.6nF  [FP-CGA4J-IPC_B]
C22  1pF  [CAPC1005X55X25NL05T10]
L1  3.3uH  [FP-SRN8040-MFG]
R21  10K 1%  [RESC0603(1608)_N]
R32  Jumper  [RESC0805(2012)_N]
R35  Jumper  [RESC0805(2012)_N]
R41  10K 1%  [RESC0603(1608)_N]
R42  18.7kohm  [RESC1608X55X30LL15T15]
R43  51.5kohm  [FP-CRCW0603-HPe3-IPC_B]
R44  3.24kohm  [RESC1608X55X30ML15T15]
U2  Voltage Regulator  [TPS5432DDAR]

### Ports
3.3V, GND, VIN

### Nets
3.3V: R35.2 ; port 3.3V  [project net 3V3]
5V: R32.1 ; port VIN
GND: C17.2 C18.2 C19.1 C20.2 C21.2 C22.1 R42.1 R44.1 U2.4(GND) U2.9(PWPD) ; port GND
NetC8_1: C8.1 L1.1 U2.3(PH)
NetC8_2: C8.2 U2.1(BOOT)
NetC16_1: C16.1 C20.1 L1.2 R35.1 R41.2
NetC16_2: C16.2 R41.1 R44.2 U2.5(VSENSE)
NetC17_1: C17.1 R21.1
NetC18_1: C18.1 C19.2 R32.2 R43.2 U2.2(VIN)
NetC21_1: C21.1 U2.8(SS)
NetC22_2: C22.2 R21.2 U2.6(COMP)
NetR42_2: R42.2 R43.1 U2.7(EN)

### Notes on the sheet
- Jumpers for power and ground are to validate if power works or not and if it connects to GND
- VIN: 4.8V to 5.2V
  OUT: 3.3V up to 5A
- Power Schematics of Whiskeypedia
- Water Dispenser
- Voltage Regulator
- 1.2.2
- Xiyue Luo & Shuyi Ying

### Library data of the parts
C8 = CMP-1035-02584-1: as C1 on sheet FTDI; Technology: SMT; Max Thickness: 1 mm; Value: 100nF; Rated Voltage: 16 V
C16 = CMP-03422-000674-1: CAP CER 390PF 50V X7R 0603; Manufacturer: YAGEO; Manufacturer Part Number: CC0603KRX7R9BB391; Tolerance: 0.1; Temperature Coefficient: 15%; Material: Ceramic; Device Class L1: Passive Components; Height: 0.9mm; RoHS: TRUE; Octopart: https://octopart.com/cc0603krx7r9bb391-yageo-39467837; Device Class L3: Ceramic Capacitors; ComponentLink2Description: Datasheet; Category: Cap; Digikey Description: CAP CER 390PF 50V X7R 0603; Device Class L2: Capacitors; Voltage: 50 V; Temperature Range Low: -55°C; Temperature: -55°C to +125°C; Temperature Range High: +125°C; Temperature Characteristic: X7R; ComponentLink2URL: http://www.yageo.com/documents/recent/UPY-GPHC_X7R_6.3V-to-50V_18.pdf; Package: CC0603-DA; Mouser Description: 0603 390 pF 50 V ±10 % Tolerance X7R SMT Multilayer Ceramic Capacitor; Lead Free: Yes; Footprint Url: http://www.yageo.com/exep/pages/download/literatures/UPY-C_GEN_24.pdf; Automotive: No; Value: 390 pF; Voltage Rating: 50 V; Capacitance: 390 pF
C17 = CMP-2007-03491-2: Chip Multilayer Ceramic Capacitors for General Purpose, 0805, 18000pF, C0G, 30ppm/°C, 5%, 50V; Packaging: Tape and Reel; Case/Package: 0805; Package Quantity: 10000; Termination: SMD/SMT; Case Code (Imperial): 0805; Thickness: 0.053inch; Dielectric: C0G; Tolerance: 5%; Max Operating Temperature: 125°C; Voltage Rating: 50V; Min Operating Temperature: -55°C; Capacitance: 18nF; Width: 0.049inch; Voltage Rating (DC): 50V; Depth: 1.25mm; Radiation Hardening: No; Height: 1.25mm; Mount: Surface Mount; Length: 2mm; Case Code (Metric): 2012
C18 = CMP-06035-039918-1: Chip Multilayer Ceramic Capacitors for General Purpose, 0805, 22uF, X5R, 15%, 20%, 10V; Dissipation Factor: 0.035%; Min Operating Temperature: -55°C; Voltage Rating (DC): 10V; Height: 1.25mm; Depth: 1.25mm; Max Operating Temperature: 85°C; Width: 1.25mm; Lead Free: Lead Free; Dielectric Material: Ceramic; Weight: 0.000335oz; Tolerance: 20%; Voltage Rating: 10V; Case Code (Metric): 2012; Termination: SMD/SMT; Length: 2mm; Thickness: 0.057inch; Case/Package: 0805; Packaging: Tape and Reel; Voltage: 10V; Case Code (Imperial): 0805; Resistor Type: Ceramic; Package Quantity: 3000; Mount: Surface Mount; Capacitance: 22uF; Dielectric: X5R
C19 = CMP-2008-04586-1: Part Number: GRM155R70J104KA01D; Manufacturer: Murata
C20 = CMP-2000-06344-2: Chip Multilayer Ceramic Capacitors for General Purpose, 1206, 47uF, X5R, 15%, 20%, 6.3V; Package Quantity: 2000; Mount: Surface Mount; Length: 3.2mm; Thickness: 0.071inch; Lead Free: Lead Free; Tolerance: 20%; Width: 0.063inch; Depth: 1.6mm; Case/Package: 1206; Dielectric: X5R; Radiation Hardening: No; Packaging: Tape and Reel; Voltage Rating (DC): 6.3V; Termination: SMD/SMT; Height: 1.6mm; Max Operating Temperature: 85°C; Case Code (Metric): 3216; Case Code (Imperial): 1206; Voltage: 6.3V; Voltage Rating: 6.3V; Capacitance: 47uF; Min Operating Temperature: -55°C; Material: Ceramic; REACH SVHC: No SVHC
C21 = CMP-08246-002383-1: Cap Ceramic 5.6nF 50V C0G 5% Pad SMD 0805 +125°C Automotive T/R; Max Operating Temperature: 125°C; Width: 0.049inch; Ratings: AEC-Q200; Voltage Rating: 50V; Dielectric: C0G; Capacitance: 5.6nF; Length: 2mm; Min Operating Temperature: -55°C; Packaging: Tape and Reel; Thickness: 0.028inch; Mount: Surface Mount; Case/Package: 0805; Composition: Ceramic; Voltage Rating (DC): 50V; Case Code (Metric): 2012; REACH SVHC: No SVHC; Package Quantity: 1; Height: 0.6mm; Tolerance: 5%; Termination: SMD/SMT; Weight: 0.000194oz; Depth: 1.25mm; Case Code (Imperial): 0805
C22 = CMP-2008-04277-1: Part Number: GRM1555C1H1R0CA01D; Manufacturer: Murata
L1 = CMP-07248-000074-1: FIXED IND 3.3UH 5.6A 21 MOHM SMD; Tolerance: 30%; Shielding: Shielded; DC Resistance (DCR): 21mR; Self Resonant Frequency: 34MHz; Material: Steel; Saturation Current: 5.5A; Sample Rate (Hz): 100kHz; Core Material: Ferrite; Depth: 8.3mm; Inductance: 3.3uH; Current Rating: 5.6A; DC Current: 5.6A; Max Operating Temperature: 125°C; REACH SVHC: No SVHC; Package Quantity: 1000; Resistor Type: Wirewound; RoHS Compliant: Yes; Width: 8mm; Case/Package: Nonstandard; Height: 4mm; Min Operating Temperature: -40°C; Number of Pins: 2; Series: SRN8040; RMS Current (Irms): 5.6A; Mount: Surface Mount; Military Standard: Not; Max DC Current: 5.6A; Termination: SMD/SMT; Packaging: Tape and Reel; Test Frequency: 100kHz; Height - Seated (Max): 0.157inch; Length: 8mm; Inductance Tolerance: 30%
R21 R41 = CMP-1012-00623-1: as R11 on sheet MCU; Power: 0.1 W; Tolerance: 1 %; Technology: SMT
R32 R35 = CMP-1013-00001-1: as R22 on sheet MAIN; Technology: SMT; Power: None
R42 = CMP-2000-00304-1: Part Number: ERJ-3EKF1872V; Manufacturer: Panasonic
R43 = CMP-02407-012018-1: RES Thick Film, 51.1kΩ, 1%, 0.33W, 100ppm/°C, 0603; Power Rating: 250mW; Voltage Rating: 75V; Resistance: 51.1kR; Weight: 7.1E-05oz; Lead Free: Lead Free; Termination: SMD/SMT; Resistor Type: Thick Film; Packaging: Tape and Reel; Max Operating Temperature: 155°C; Min Operating Temperature: -55°C; Temperature Coefficient: 100ppm/°C; Features: Automotive AEC-Q200; Case/Package: 0603; Height: 0.022inch; Number of Terminations: 2; Length: 0.063inch; Width: 0.033inch; Case Code (Imperial): 0603; Series: CRCW-HP; RoHS Compliant: Yes; Max Power Dissipation: 250mW; Tolerance: 1%; Case Code (Metric): 1608; Package Quantity: 5000
R44 = CMP-2000-00432-1: Part Number: ERJ-3EKF3241V; Manufacturer: Panasonic
U2 = TPS5432DDAR: TPS5432 2.95V to 6V Input, 3A Sy; Manufacturer: Texas Instruments; Switching Frequency: 700kHz; Output Voltage: 4.5V; Number of Outputs: 1; Synchronous Rectifier: Yes; Quiescent Current: 360uA; Output Type: Adjustable; Supplier 1: Digi-Key; Supplier Part Number 1: 296-30316-1-ND; Manufacturer Part Number: TPS5432DDAR; RoHS: Yes; Category: Voltage Regulators - Switching; Stock 1: 3364; Pricing 1: 1=0.92000, 10=0.80800, 25=0.75920, 100=0.61950, 250=0.57544, 500=0.48972, 1000=0.40425 (USD); Mount: Surface Mount; Case/Package: HSOP; Number of Pins: 8; Min Operating Temperature: -40°C; Max Operating Temperature: 125°C; Output Current: 3A; Min Input Voltage: 2.95V; Packaging: Tape and Reel; Package Quantity: 1; Max Output Current: 3A; Max Input Voltage: 6V; Operating Supply Voltage: 6V; Series: -; Radiation Hardening: No; Lead Free: Lead Free; RoHS Compliant: Yes; ComponentLink1URL: https://datasheet.ciiva.com/4905/slvsb89-121419-4905890.pdf?src-supplier=Mouser; ComponentLink1Description: https://datasheet.ciiva.com/4905/slvsb89-121419-4905890.pdf?src-supplier=Mouser; ComponentLink2URL: https://datasheet.ciiva.com/15268/tps5432-15268021.pdf?src-supplier=Arrow+Europe; ComponentLink2Description: https://datasheet.ciiva.com/15268/tps5432-15268021.pdf?src-supplier=Arrow+Europe; ComponentLink3URL: https://datasheet.ciiva.com/3221/tps5432-3221580.pdf?src-supplier=Avnet; ComponentLink3Description: https://datasheet.ciiva.com/3221/tps5432-3221580.pdf?src-supplier=Avnet; ComponentLink4URL: https://datasheet.ciiva.com/6597/tps5432-6597980.pdf?src-supplier=Digi-Key; ComponentLink4Description: https://datasheet.ciiva.com/6597/tps5432-6597980.pdf?src-supplier=Digi-Key; ComponentLink5URL: https://datasheet.ciiva.com/6597/tps5432-6597982.pdf?src-supplier=Digi-Key; ComponentLink5Description: https://datasheet.ciiva.com/6597/tps5432-6597982.pdf?src-supplier=Digi-Key

## Sheet ActuatorSensor.SchDoc
size A4
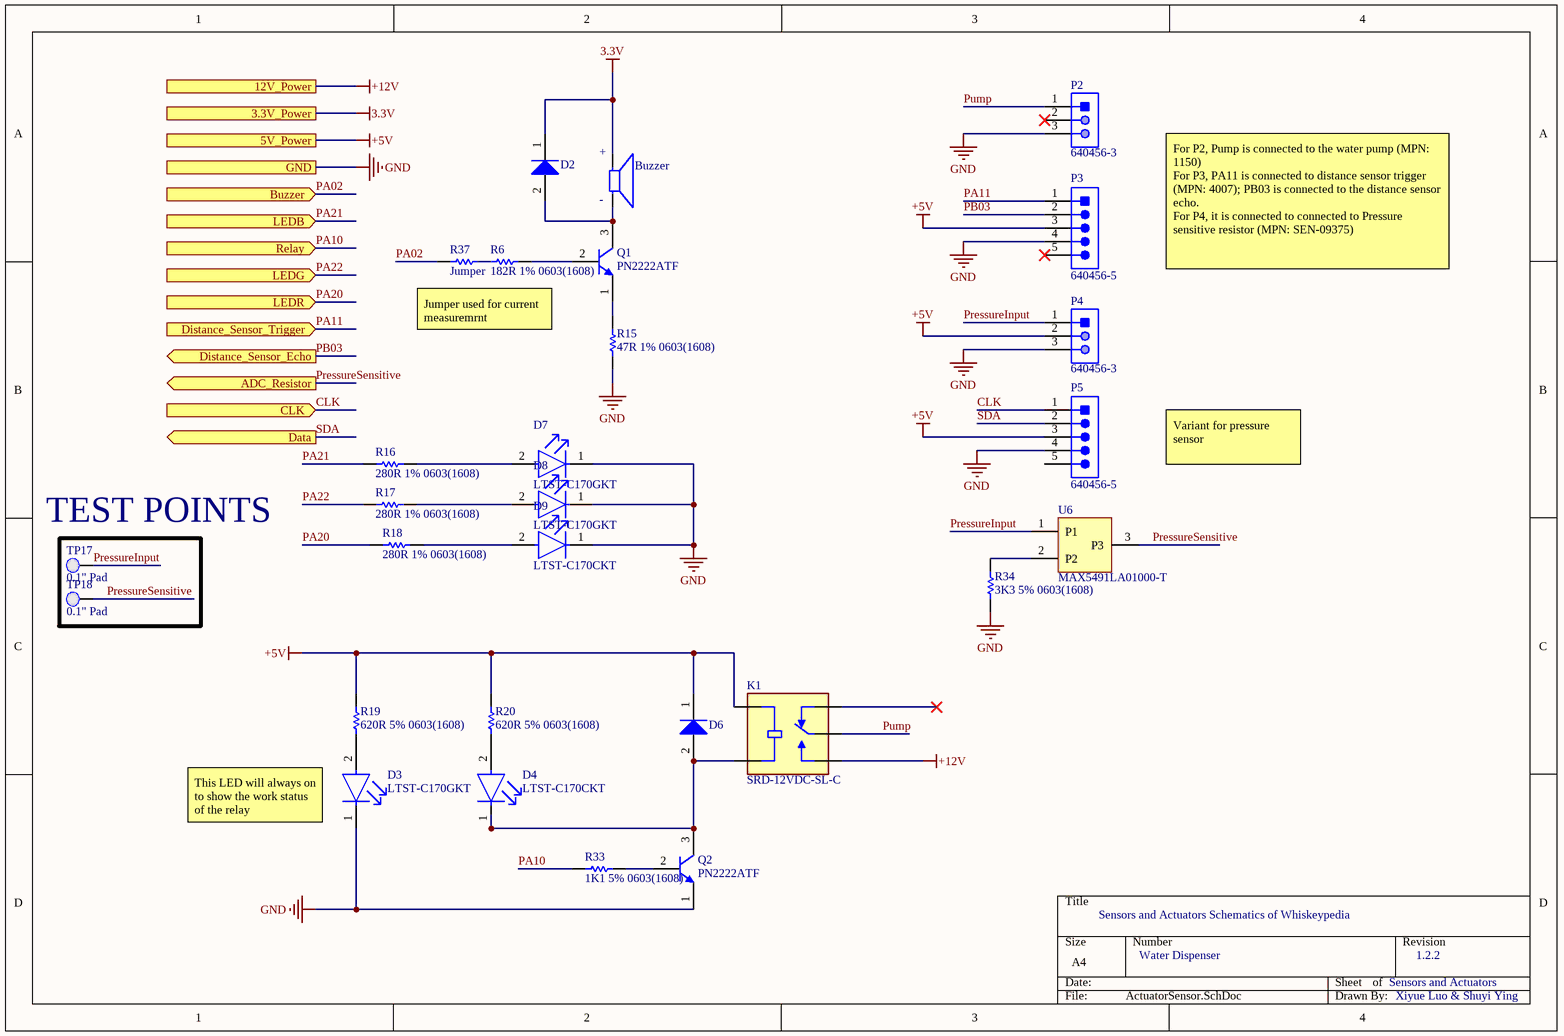
[diagram p5: ActuatorSensor.SchDoc]

### Parts
Buzzer  Buzzer  [Buzzer]  (value not drawn)
D2  BAS16HT1G  [ONSC-SOD-323-2-477-02_V]  (value not drawn)
D3  LTST-C170GKT  [FP-LTST-C170GKT-MFG]
D4  LTST-C170CKT  [FP-LTST-C170CKT-MFG]
D6  BAS16HT1G  [ONSC-SOD-323-2-477-02_V]  (value not drawn)
D7  LTST-C170GKT  [FP-LTST-C170GKT-MFG]
D8  LTST-C170GKT  [FP-LTST-C170GKT-MFG]
D9  LTST-C170CKT  [FP-LTST-C170CKT-MFG]
K1  SRD-12VDC-SL-C  [RELAY_SRD-12VDC-SL-C]
P2  640456-3  [TECO-640456-3]
P3  640456-5  [TECO-640456-5]
P4  640456-3  [TECO-640456-3]
P5  640456-5  [TECO-640456-5]
Q1  PN2222ATF  [FAIR-TO-92-3]
Q2  PN2222ATF  [FAIR-TO-92-3]
R6  182R 1% 0603(1608)  [RESC0603(1608)_N]
R15  47R 1% 0603(1608)  [RESC0603(1608)_M]
R16  280R 1% 0603(1608)  [RESC0603(1608)_M]
R17  280R 1% 0603(1608)  [RESC0603(1608)_M]
R18  280R 1% 0603(1608)  [RESC0603(1608)_M]
R19  620R 5% 0603(1608)  [RESC0603(1608)_M]
R20  620R 5% 0603(1608)  [RESC0603(1608)_M]
R33  1K1 5% 0603(1608)  [RESC0603(1608)_L]
R34  3K3 5% 0603(1608)  [RESC0603(1608)_N]
R37  Jumper  [RESC0805(2012)_N]
TP17  0.1" Pad  [PCBComponent]  (no BOM)
TP18  0.1" Pad  [PCBComponent]  (no BOM)
U6  MAX5491LA01000-T  [MAXM-U3-2_L]

### Ports
3.3V_Power, 5V_Power, 12V_Power, ADC_Resistor (out), Buzzer (in), CLK (in), Data (out), Distance_Sensor_Echo (out), Distance_Sensor_Trigger (in), GND, LEDB (in), LEDG (in), LEDR (in), Relay (in)

### Nets
3.3V: Buzzer.1 D2.1(K) ; port 3.3V_Power  [project net 3V3]
+5V: D6.1(K) K1.COIL1 P3.3(TXO) P4.2 P5.3(TXO) R19.2 R20.2 ; port 5V_Power  [project net 5V]
+12V: K1.NO ; port 12V_Power  [project net 12V]
GND: D3.1(C) D7.1(C) D8.1(C) D9.1(C) P2.3 P3.4(VCC) P4.3 P5.4(VCC) Q2.1(E) R15.1 R34.1 ; port GND
CLK: P5.1(DTR) ; port CLK  [project net PA03]
PA02: R37.1 ; port Buzzer
PA10: R33.1 ; port Relay
PA11: P3.1(DTR) ; port Distance_Sensor_Trigger
PA20: R18.1 ; port LEDR
PA21: R16.1 ; port LEDB
PA22: R17.1 ; port LEDG
PB03: P3.2(RXI) ; port Distance_Sensor_Echo
PressureInput: P4.1 TP17.1(PAD) U6.1(P1)
PressureSensitive: TP18.1(PAD) U6.3(P3) ; port ADC_Resistor  [project net PA04]
Pump: K1.COM P2.1
SDA: P5.2(RXI) ; port Data  [project net PA06]
NetBuzzer_2: Buzzer.2 D2.2(A) Q1.3(C)
NetD3_2: D3.2(A) R19.1
NetD4_1: D4.1(C) D6.2(A) K1.COIL2 Q2.3(C)
NetD4_2: D4.2(A) R20.1
NetD7_2: D7.2(A) R16.2
NetD8_2: D8.2(A) R17.2
NetD9_2: D9.2(A) R18.2
NetQ1_1: Q1.1(E) R15.2
NetQ1_2: Q1.2(B) R6.2
NetQ2_2: Q2.2(B) R33.2
NetR6_1: R6.1 R37.2
NetR34_2: R34.2 U6.2(P2)

Not connected (* = marked no-connect by the designer): K1 NC*; P2 2*; P3 5(CTS)*; P5 5(CTS)

### Notes on the sheet
- For P2, Pump is connected to the water pump (MPN: 1150)
  For P3, PA11 is connected to distance sensor trigger (MPN: 4007); PB03 is connected to the distance sensor echo.
  For P4, it is connected to connected to Pressure sensitive resistor (MPN: SEN-09375)
- Jumper used for current measuremrnt
- Variant for pressure sensor
- (near TP17) TEST POINTS
- This LED will always on to show the work status of the relay
- Sensors and Actuators Schematics of Whiskeypedia
- Water Dispenser
- Sensors and Actuators
- 1.2.2
- Xiyue Luo & Shuyi Ying
- (in symbol Buzzer) +; -

### Library data of the parts
Buzzer = Buzzer: 8.5 mm, 5 Vo-p, 100 dB, Surface Mount (SMT), Magnetic Audio Transducer Buzzer; Manufacturer: CUI Devices; Manufacturer Part Number: CMT-8504-100-SMT-TR; Supplier 1: Digi-Key; Supplier Part Number 1: 102-CMT-8504-100-SMT-CT-ND; RoHS: No; Category: Buzzers; Stock 1: 90590; Pricing 1: 1=1.57000, 10=1.30300, 25=1.20440, 50=1.13300, 100=1.06420, 500=0.91430 (USD)
D2 D6 = CMP-1054-00068-1: Switching Diode, 2-Pin SOD-323, Pb-Free, Tape and Reel; Manufacturer: On Semiconductor; Configuration: Single; IF Max (A): 0.2; trr Max (ns): 6; Packing: Tape and Reel; ComponentLink2URL: http://www.onsemi.com/pub_link/Collateral/BAS16HT1-D.PDF; ComponentLink3Description: Package Specification; RoHS: TRUE; PackageDescription: 2-Pin SOD, Body 1.7 x 1.25 mm; PackageReference: SOD-323-2-477-02; PartNumber: BAS16HT1G; ComponentLink1URL: http://www.onsemi.com/; Mounting Technology: Surface Mount; ComponentLink1Description: Manufacturer URL; ComponentLink2Description: Datasheet; DatasheetVersion: Rev. 11; PackageVersion: Rev. H, 03/2007; ComponentLink3URL: http://www.onsemi.com/pub_link/Collateral/477-02.PDF.1
D3 D7 D8 = CMP-1674-00002-6: LED GREEN CLEAR SMD; Dominant Wavelength: 569nm; Lens Style: Diffused; Forward Voltage: 2.1V; Number of Elements: 1; Wavelength: 565nm; Luminous Intensity: 6mcd; Test Current: 10mA; Power Dissipation: 100mW; Reverse Voltage: 5V; Forward Current: 30mA; Viewing Angle: 130°; Lens Color: Colorless; Min Operating Temperature: -55°C; Number of Pins: 2; Max Operating Temperature: 85°C; Color: Green; Radiation Hardening: No; Illumination Color: Green; Case Code (Metric): 2012; Lens Transparency: Clear; Case/Package: 0805; Width: 1.25mm; Case Code (Imperial): 0805; Package Quantity: 1; Height: 1.1mm; Depth: 1.25mm; Length: 2mm; Power Rating: 100mW; Lead Free: Lead Free; Number of LEDs: 1; Packaging: Tape and Reel; Mount: Surface Mount; Voltage: 5V
D4 D9 = CMP-1674-00001-6: LED RED CLEAR SMD; Number of Elements: 1; Power Dissipation: 100mW; Lens Color: Colorless; Voltage: 5V; Wavelength: 660nm; Viewing Angle: 130°; Forward Current: 40mA; Luminous Intensity: 10mcd; Forward Voltage: 1.8V; Test Current: 10mA; Dominant Wavelength: 638nm; Lens Style: Diffused; Max Operating Temperature: 85°C; Packaging: Tape and Reel; Case/Package: 0805; Radiation Hardening: No; Illumination Color: Red; Max Power Dissipation: 100mW; Min Operating Temperature: -55°C; Length: 2mm; Reverse Voltage: 5V; Lead Free: Lead Free; Color: Red; Case Code (Imperial): 0805; Package Quantity: 1; Mount: Surface Mount; Case Code (Metric): 2012; Height: 1.1mm; Power Rating: 100mW; Lens Transparency: Clear; Number of LEDs: 1; Number of Pins: 2; Depth: 1.25mm; Width: 1.25mm
K1 = SRD-12VDC-SL-C: General Purpose Non Latching 12VDC SPDT Through Hole Relays RoHS; MF: Songle Relay; MP: SRD-12VDC-SL-C; Package: Package; Availability: No availability data; Price: None; SnapEDA_Link: https://www.snapeda.com/parts/SRD-12VDC-SL-C/Songle%20Relay/view-part/5710428/?ref=snap; Value: *; Check_prices: https://www.snapeda.com/parts/SRD-12VDC-SL-C/Songle%20Relay/view-part/5710428/?ref=eda
P2 P4 = CMP-2000-05418-1: as P1 on sheet MAIN; Manufacturer URL: http://www.te.com/; Datasheet URL: https://datasheet.ciiva.com/16456/eng-ds-82056-mta-0608-16456886.pdf; Flammability Rating: UL94V-0; Mounting Type: PCMount; Contact Mating Area Plating: Tin; Datasheet Version: Jun-08; Number of Rows: 1; Termination: Solder; Type: PCBPlug; Length, Pin: 0.14 / "; Color: White; Contact Plating: Tin; Contact Shape: Square; Number of Contacts: 3; Size, Post: 0.025 / in.; Length, Terminal Post: 0.14 / in.; Length, Overall: 0.3 / "
P3 P5 = CMP-1684-00014-1: Male Header, Pitch 2.54 mm, 1 x 5 Position, Height 10.03 mm, Tail Length 3.56 mm, / -55 to 105 degC, RoHS, Bulk; Manufacturer: TE Connectivity; Material, Housing: Polyester; Brand/Series: MTA-100Series; Color, Housing: White; Current, Rating: 5 / A; Temperature, Operating: -55to+105 / °C; Connector Type: MTA-100; Agency Approvals: CSA,UL; Material, Contact: CopperAlloy; Mounting Hole Size: 0.04 / "; Voltage, Rating: 250 / V; Contact Termination Area Plating: Tin; Pin Spacing: 0.1 / "; Primary Type: InterconnectSystem; Special Features: Pinstrip; Mount Angle: Vertical; Contact Centerline Spacing: 0.100 / in.; Number of Contacts: 5; Standards: RoHSCompliant,ELVCompliant,UL94V-0; Angle: Straight; Length, Terminal Post: 0.14 / in.; Manufacturer URL: http://www.te.com; Flammability Rating: UL94V-0; Mounting Type: PCMount; Termination: Solder; Package Reference: THD; Length, Overall: 0.5 / "; Contact Mating Area Plating: Tin; Length, Pin: 0.14 / "; Datasheet URL: http://sigma.octopart.com/77881742/technical_drawing/TE-Connectivity-640456-5.pdf; Package Description: Male Header, Pitch 2.54 mm, 1 x 5 Position, Height 10.03 mm, Tail Length 3.56 mm; Datasheet Version: Rev. W3; Contact Plating: Tin; Color: White; Number of Positions: 5; Type: PCBPlug; Contact Shape: Square; Number of Rows: 1; Size, Post: 0.025 / in.
Q1 Q2 = CMP-2000-06911-1: NPN General-Purpose Amplifier, 40 V, -55 to 150 degC, 3-Pin TO-92, RoHS, Tape and Reel; Manufacturer: FairchildSemiconductor; Configuration: Single; Collector-Emitter Saturation Voltage: 1V; Collector- Emitter Voltage VCEO Max: 40V; Unit Weight: 0.008466oz; Maximum DC Collector Current: 1A; DC Collector/Base Gain hfe Min: 100; Emitter- Base Voltage VEBO: 6V; Maximum Power Dissipation: 625mW; DC Current Gain hFE Max: 300; Gain Bandwidth Product fT: 300MHz; Collector- Base Voltage VCBO: 75V; Mounting Style: ThroughHole; Package Description: 3-Pin Transistor Outline Package, Body Dia 4.79 mm, Pitch 2.6 mm; Mounting Technology: ThroughHole; RoHS: Details; Brand: FairchildSemiconductor; Minimum Operating Temperature: -55C; Package / Case: TO-92-3KinkedLead; Package Reference: TO-92; Series: PN2222; Packaging: Reel; Datasheet Version: Rev. 1.1.0, 07/2014; Datasheet URL: https://www.fairchildsemi.com/datasheets/PN/PN2222A.pdf; Maximum Operating Temperature: +150C; Transistor Polarity: NPN; Factory Pack Quantity: 2000; Manufacturer URL: https://www.fairchildsemi.com/; <PCN>: http://www.mouser.com/PCN/3.26.10LTBDFairchild.pdf; Product Category: BipolarTransistors-BJT
R6 = CMP-1012-00425-1: 182R 0.1W 1% 0603 (1608 Metric)  SMD; Case-EIA: 0603; Value: 182.00 Ohm; Case-Metric: 1608; Technology: SMT; Tolerance: 1 %; Power: 0.1 W
R15 = CMP-1012-00360-1: 47R 0.1W 1% 0603 (1608 Metric)  SMD; Case-EIA: 0603; Case-Metric: 1608; Value: 47.00 Ohm; Power: 0.1 W; Technology: SMT; Tolerance: 1 %
R16-R18 = CMP-1012-00446-1: 280R 0.1W 1% 0603 (1608 Metric)  SMD; Value: 280.00 Ohm; Case-Metric: 1608; Case-EIA: 0603; Power: 0.1 W; Tolerance: 1 %; Technology: SMT
R19 R20 = CMP-1012-00069-1: 620R 0.1W 5% 0603 (1608 Metric)  SMD; Case-Metric: 1608; Value: 620.00 Ohm; Case-EIA: 0603; Tolerance: 5 %; Technology: SMT; Power: 0.1 W
R33 = CMP-1012-00075-1: 1K1 0.1W 5% 0603 (1608 Metric)  SMD; Case-Metric: 1608; Value: 1100.00 Ohm; Case-EIA: 0603; Power: 0.1 W; Technology: SMT; Tolerance: 5 %
R34 = CMP-1012-00086-1: 3K3 0.1W 5% 0603 (1608 Metric)  SMD; Case-EIA: 0603; Value: 3300.00 Ohm; Case-Metric: 1608; Technology: SMT; Tolerance: 5 %; Power: 0.1 W
R37 = CMP-1013-00001-1: as R22 on sheet MAIN; Technology: SMT; Power: None
TP17 TP18 = 0.1" Pad-A.4
U6 = CMP-0023-00618-2: 30k 2 kV ESD Precision-Matched Resistor-Divider, -40 to 85 degC, 3-pin SOT (U3-2), Tape and Reel; Code_JEDEC: TO236; Applications: Precision Voltage Divider; Mounting Technology: Surface Mount; PackageReference: U3-2; PackageDescription: 3-Pin Small-Outline Transistor Package (U3-2), Body 2.92 x 1.3 mm, Pitch 0.95 mm; ComponentLink3URL: http://pdfserv.maximintegrated.com/package_dwgs/21-0051.PDF; ComponentLink1Description: Manufacturer URL; DatasheetVersion: Rev. 3; PackageVersion: Rev. J, 06/2012; PartNumber: MAX5491LA01000-T; ComponentLink3Description: Package Specification; ComponentLink1URL: http://www.maximintegrated.com/; ComponentLink2Description: Datasheet; ComponentLink2URL: http://datasheets.maximintegrated.com/en/ds/MAX5491.pdf